# EAGLE design Rwanda Sensor Breakout (EAGLE 9.5.2)
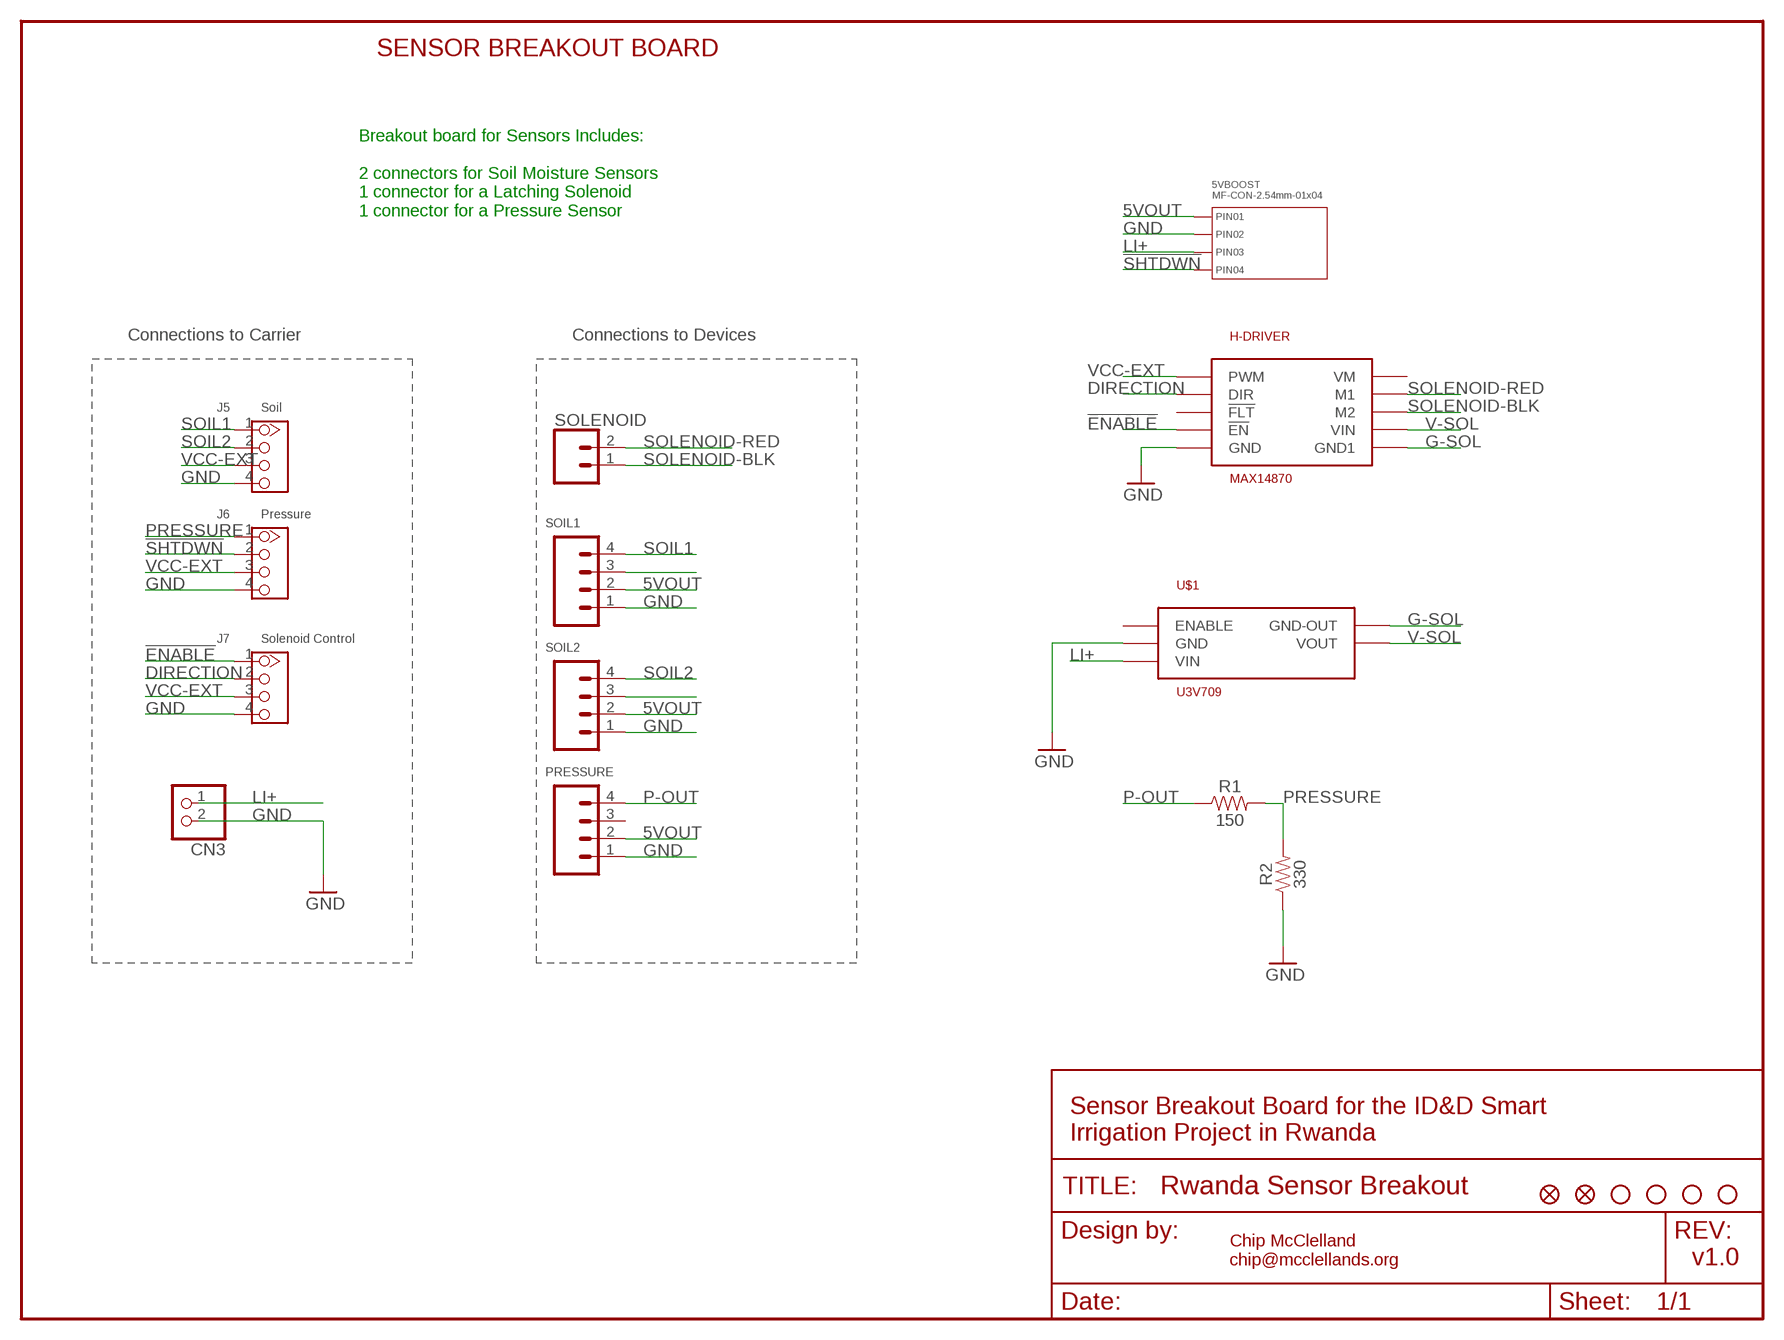
[diagram p0: schematic, sheet 1]

## Parts
5VBOOST  MF-CON-2.54mm-01x04  U1V11F5_PTH_2.54MM  [PTH_2.54MM_01X04]
CN3  JST_2PIN-SMT-RA  [JST-PH-2-SMT-RA]
FD1  FIDUCIALUFIDUCIAL  [FIDUCIAL-MICRO]
FD2  FIDUCIALUFIDUCIAL  [FIDUCIAL-MICRO]
FRAME1  FRAME-LETTER  [CREATIVE_COMMONS]
H-DRIVER  MAX14870  [MAX14870-BREAKOUT]
J5  Soil  GROVE-CONNECTOR-DIP(4P-2.0)  [HW4-2.0]
J6  Pressure  GROVE-CONNECTOR-DIP(4P-2.0)  [HW4-2.0]
J7  Solenoid Control  GROVE-CONNECTOR-DIP(4P-2.0)  [HW4-2.0]
JP3  STAND-OFF  [STAND-OFF]
JP4  STAND-OFF  [STAND-OFF]
JP5  STAND-OFF  [STAND-OFF]
JP6  STAND-OFF  [STAND-OFF]
PRESSURE  Soil  CONN_04SCREW  [SCREWTERMINAL-3.5MM-4]
R1  150  0.3OHM-0805-1/8W-1%  [0805]
R2  330  0.3OHM-0805-1/8W-1%  [0805]
SOIL1  Soil  CONN_04SCREW  [SCREWTERMINAL-3.5MM-4]
SOIL2  Soil  CONN_04SCREW  [SCREWTERMINAL-3.5MM-4]
SOLENOID  CONN_025MM  [SCREWTERMINAL-5MM-2]
U$1  U3V709  [U3V70X-BREAKOUT]

## Nets
5VOUT: 5VBOOST.P$1(PIN1) PRESSURE.2 SOIL1.2 SOIL2.2
!ENABLE: H-DRIVER.P$4(!EN) J7.1
!SHTDWN: 5VBOOST.P$4(PIN4) J6.2
DIRECTION: H-DRIVER.P$2(DIR) J7.2
G-SOL: H-DRIVER.P$6(GND1) U$1.GOUT1(GND-OUT) U$1.GOUT(GND-OUT)
GND: 5VBOOST.P$2(PIN2) CN3.2 H-DRIVER.P$5(GND) J5.4 J6.4 J7.4 PRESSURE.1 R2.1 SOIL1.1 SOIL2.1 U$1.GIN1(GND) U$1.GIN(GND)
LI+: 5VBOOST.P$3(PIN3) CN3.1 U$1.VIN U$1.VIN1(VIN)
N$2: SOIL1.3
N$7: SOIL2.3
P-OUT: PRESSURE.4 R1.1
PRESSURE: J6.1 R1.2 R2.2
SOIL1: J5.1 SOIL1.4
SOIL2: J5.2 SOIL2.4
SOLENOID-BLK: H-DRIVER.P$8(M2) SOLENOID.1
SOLENOID-RED: H-DRIVER.P$9(M1) SOLENOID.2
V-SOL: H-DRIVER.P$7(VIN) U$1.VOUT U$1.VOUT1(VOUT)
VCC-EXT: H-DRIVER.P$1(PWM) J5.3 J6.3 J7.3
Unconnected: H-DRIVER.P$3(!FLT) H-DRIVER.P$10(VM) PRESSURE.3 U$1.ENABLE

## Notes on the sheet
- SENSOR BREAKOUT BOARD
- Breakout board for Sensors Includes:
  
  2 connectors for Soil Moisture Sensors
  1 connector for a Latching Solenoid
  1 connector for a Pressure Sensor
- Connections to Carrier | Connections to Devices
- Sensor Breakout Board for the ID&D Smart
  Irrigation Project in Rwanda
- Chip McClelland
  chip@mcclellands.org
- v1.0

## Library data of the parts
5VBOOST = Rwanda-Sensor-Breakout:U1V11F5: Library: MF_Connectors Description: Header Connector with 04 Positions and 01 Rows. Use the LABEL Attribute to label the pin on the schematic and PCB. You can remove the attributes on the PCB by using the SMASH function on the part and then deleting the text.; HOUSEPART: YES; MPN: MF-CON-2.54mm-01x04; POPULATE: 1; URL: https://factory.macrofab.com/part/MF-CON-2.54mm-01x04
CN3 = adafruit:JST_2PIN: JST 2-Pin Connectors of various flavors SMT-RA (S2B-PH-SM4) 4UConnector #17311 SMT (B2B-PH-SM4) THM-RA (S2B-PH) THM (B2B-PH)
FD1 FD2 = SparkFun-Aesthetics:FIDUCIAL: Fiducial Alignment Points Point-of-reference for pick-and-place machines and other optical instruments.; POPULATE: 0
FRAME1 = SparkFun-Aesthetics:FRAME-LETTER: Schematic Frame - Letter Standard 8.5x11 US Letter frame; POPULATE: 0
H-DRIVER = Rwanda-Sensor-Breakout:MAX14870
J5-J7 = OPL_Connector:GROVE-CONNECTOR-DIP(4P-2.0): 320110033; VALUE: 4P-2.0
JP3-JP6 = SparkFun-Hardware:STAND-OFF: Stand Off Drill holes for mechanically mounting via screws, standoffs, etc. Note: Use the keepout ring to avoid running the screw head into surrounding components. Variant Overviews STAND-OFF - Mechanical footprint for a #4 phillips button head screw. STAND-OFF-TIGHT - Mechanical footprint for a #4 phillips button head screw, Example SparkFun Products Screw - Phillips Head (1/4", 4-40, 10 pack) <https://www.sparkfun.com/products/10453> (PRT-10453) Screw - Phillips Head (1/2", 4-40, 10 pack) <https://www.sparkfun.com/products/10452> (PRT-10452) Screw - Phillips Head (3/4", 4-40, 10 pack) <https://www.sparkfun.com/products/10451> (PRT-10451) Screw - Phillips Head (1", 4-40, 10 pack) <https://www.sparkfun.com/products/10450> (PRT-10450); POPULATE: 0
PRESSURE SOIL1 SOIL2 = SparkFun-Connectors:CONN_04: Multi connection point. Often used as Generic Header-pin footprint for 0.1 inch spaced/style header connections On any of the 0.1 inch spaced packages, you can populate with these: Break Away Headers - Straight <https://www.sparkfun.com/products/116> (PRT-00116) Break Away Male Headers - Right Angle <https://www.sparkfun.com/products/553> (PRT-00553) Female Headers <https://www.sparkfun.com/products/115> (PRT-00115) Break Away Headers - Machine Pin <https://www.sparkfun.com/products/117> (PRT-00117) Break Away Female Headers - Swiss Machine Pin <https://www.sparkfun.com/products/743> (PRT-00743) For SCREWTERMINALS and SPRING TERMINALS visit here: Screw Terimnals on SparkFun.com <https://www.sparkfun.com/search/results?term=Screw+Terminals> (5mm/3.5mm/2.54mm spacing) This device is also useful as a general connection point to wire up your design to another part of your project. Our various solder wires solder well into these plated through hole pads. Hook-Up Wire - Assortment (Stranded, 22 AWG) <https://www.sparkfun.com/products/11375> (PRT-11375) Hook-Up Wire - Assortment (Solid Core, 22 AWG) <https://www.sparkfun.com/products/11367> (PRT-11367) View the entire wire category on our website here <https://www.sparkfun.com/categories/141> Special notes: Molex polarized connector foot print use with SKU : PRT-08231 with associated crimp pins and housings. 1MM SMD Version SKU: PRT-10208; PROD_ID: 2xCONN-08399; SF_ID: 2xPRT-08084
R1 R2 = SparkFun-Resistors:0.3OHM: 0.3Ω resistor A resistor is a passive two-terminal electrical component that implements electrical resistance as a circuit element. Resistors act to reduce current flow, and, at the same time, act to lower voltage levels within circuits. - Wikipedia; PROD_ID: RES-11622; VALUE: 0.3
SOLENOID = SparkFun-Connectors:CONN_02: Multi connection point. Often used as Generic Header-pin footprint for 0.1 inch spaced/style header connections On any of the 0.1 inch spaced packages, you can populate with these: Break Away Headers - Straight <https://www.sparkfun.com/products/116> (PRT-00116) Break Away Male Headers - Right Angle <https://www.sparkfun.com/products/553> (PRT-00553) Female Headers <https://www.sparkfun.com/products/115> (PRT-00115) Break Away Headers - Machine Pin <https://www.sparkfun.com/products/117> (PRT-00117) Break Away Female Headers - Swiss Machine Pin <https://www.sparkfun.com/products/743> (PRT-00743) For SCREWTERMINALS and SPRING TERMINALS visit here: Screw Terimnals on SparkFun.com <https://www.sparkfun.com/search/results?term=Screw+Terminals> (5mm/3.5mm/2.54mm spacing) This device is also useful as a general connection point to wire up your design to another part of your project. Our various solder wires solder well into these plated through hole pads. Hook-Up Wire - Assortment (Stranded, 22 AWG) <https://www.sparkfun.com/products/11375> (PRT-11375) Hook-Up Wire - Assortment (Solid Core, 22 AWG) <https://www.sparkfun.com/products/11367> (PRT-11367) View the entire wire category on our website here <https://www.sparkfun.com/categories/141> Special notes: Molex polarized connector foot print use with: PRT-08233 with associated crimp pins and housings. 2.54_SCREWTERM for use with PRT-10571. 3.5mm Screw Terminal footprints for PRT-08084 5mm Screw Terminal footprints for use with PRT-08432; SF_SKU: PRT-08432
U$1 = Rwanda-Sensor-Breakout:U3V709

## Net classes
0 default: width 0.203 mm, drill 0.33 mm

## Board
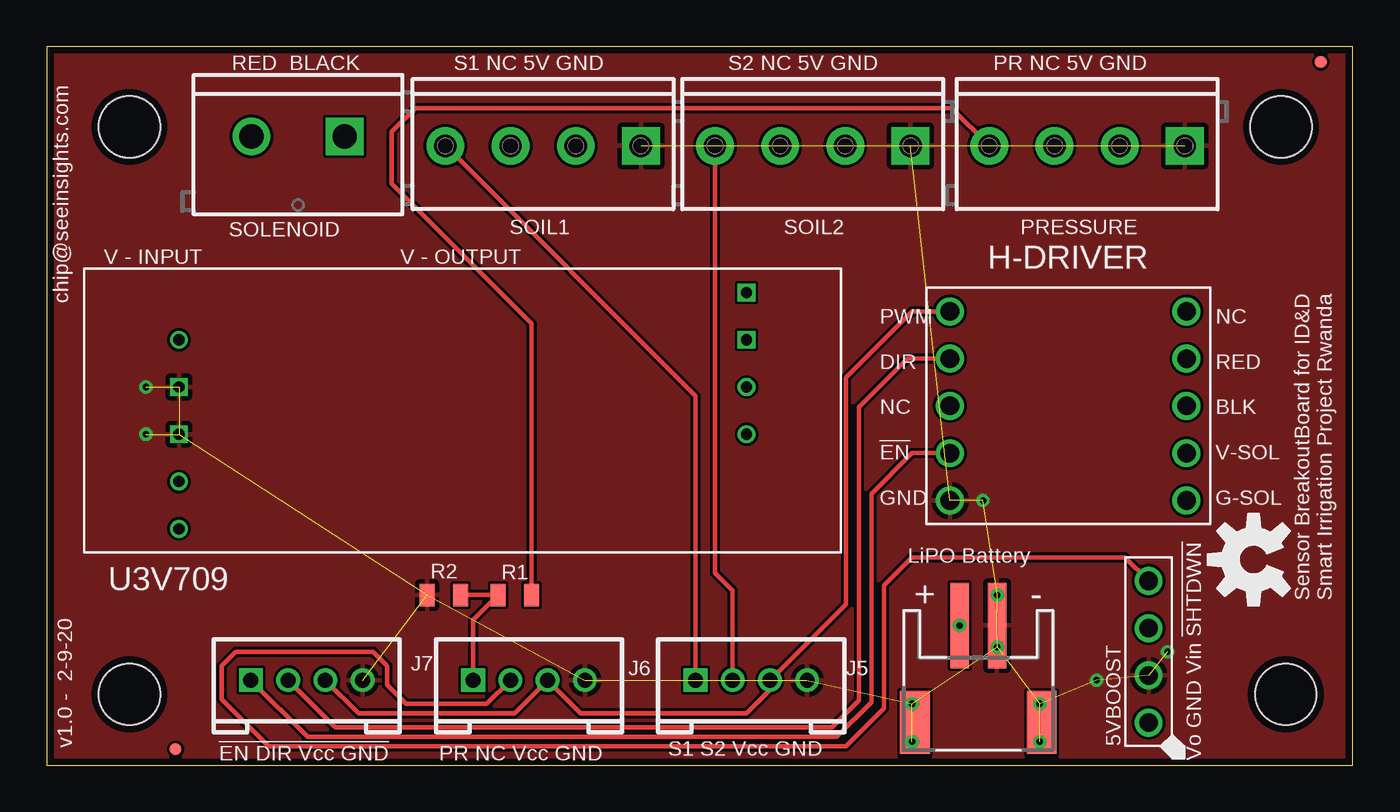
[diagram p1: board, top side]
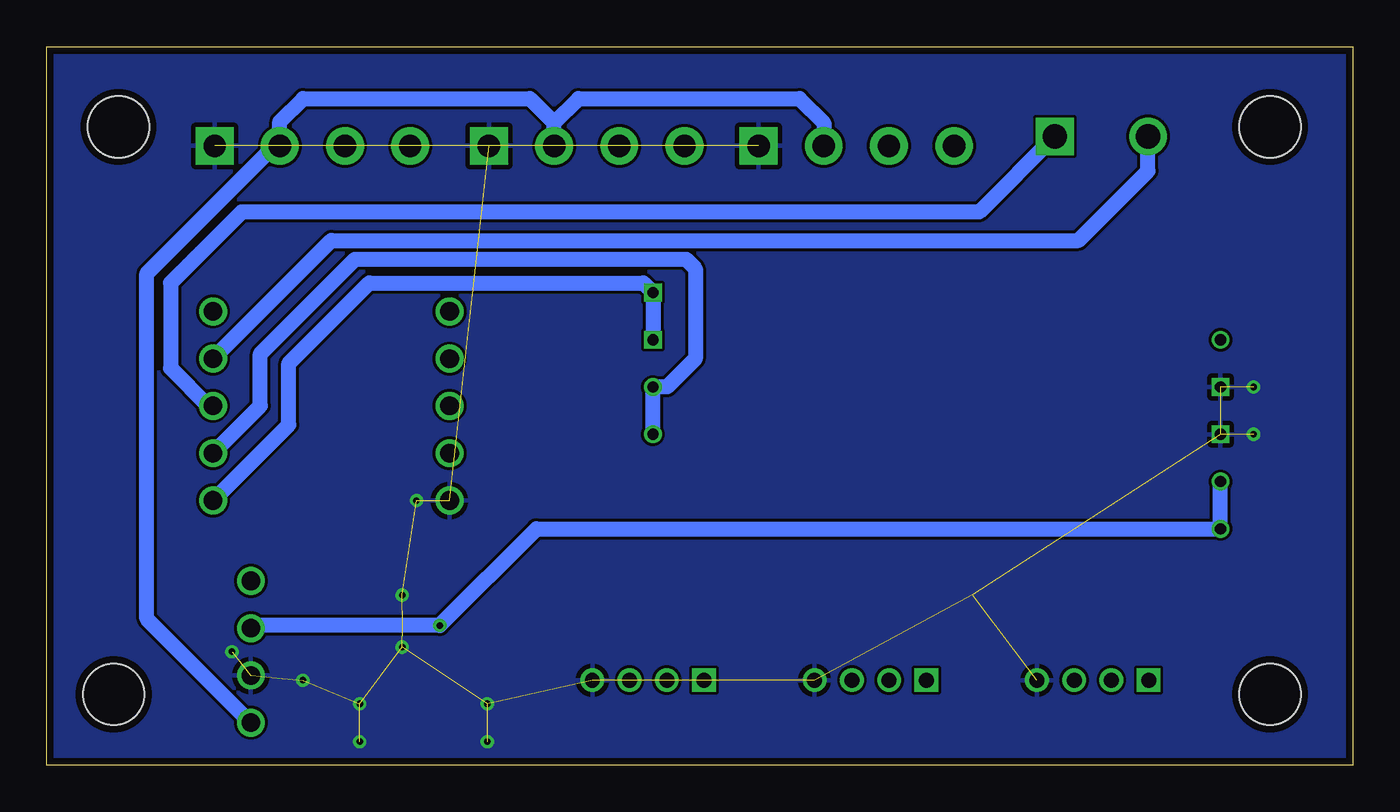
[diagram p2: board, bottom side, seen from below]

Size 70.15 x 38.61 mm. Coordinates in mm from the lower left corner, seen from the top.
Outline: 0,0 70.16,0 70.16,38.61 0,38.61 0,0
Copper layers (1*16): Top 0.0356mm / dielectric 1.5011mm / Bottom 0.0356mm
Design rules "LaenPCBOrder": minimum track width 6mil, minimum drill 13mil, track to track 6mil, track to pad 6mil, pad to pad 6mil, via to via 6mil, smd to smd 6mil, copper to edge 15mil, drill to drill 6mil, minimum pad ring 7mil, minimum via ring 7mil, stop-mask expansion 3mil, vias tented up to drill 0mil, thermal gap 10mil

### Footprints (pad centres in the part's own frame; a part is rotated, then mirrored left to right if it is on the bottom)
PTH_2.54MM_01X04 = drill 1: P$1 -3.81,0; P$2 -1.27,0; P$3 1.27,0; P$4 3.81,0
JST-PH-2-SMT-RA = smd 1 x 4.6: 1 1,-3.7; 2 -1,-3.7 | smd 1.6 x 3.4: NC1 -3.4,1.5; NC2 3.4,1.5
FIDUCIAL-MICRO = smd 0.635 x 0.635: 1 0,0
MAX14870-BREAKOUT = drill 1: P$1 -6.35,5.08; P$2 -6.35,2.54; P$3 -6.35,0; P$4 -6.35,-2.54; P$5 -6.35,-5.08; P$6 6.35,-5.08; P$7 6.35,-2.54; P$8 6.35,0; P$9 6.35,2.54; P$10 6.35,5.08
HW4-2.0 = drill 0.8 pad 1.27 square: 1 -3,0 | drill 0.8 pad 1.27: 2 -1,0; 3 1,0; 4 3,0
STAND-OFF = hole 3.302: 0,0
SCREWTERMINAL-3.5MM-4 = drill 1.2 pad 2.032 square: 1 0,0 | drill 1.2 pad 2.032: 2 3.5,0; 3 7,0; 4 10.5,0
0805 = smd 0.8 x 1.2: 1 -0.9,0; 2 0.9,0
SCREWTERMINAL-5MM-2 = drill 1.3 pad 2.032 square: 1 0,0 | drill 1.3 pad 2.032: 2 5,0
U3V70X-BREAKOUT = drill 0.6: ENABLE -15.24,3.81; VIN -15.24,-6.35; VIN1 -15.24,-3.81; VOUT 15.24,1.27; VOUT1 15.24,-1.27 | drill 0.6 square: GIN -15.24,-1.27; GIN1 -15.24,1.27; GOUT 15.24,6.35; GOUT1 15.24,3.81

### Placement (x,y rotation side)
5VBOOST  59.18,6.1 90 top
CN3  50.04,3.81 180 top
FD1  68.43,37.77 0 top
FD2  6.93,0.86 0 top
FRAME1  0.03,-11.81 0 top  (outside the outline)
H-DRIVER  54.86,19.3 0 top
J5  37.85,4.57 0 top
J6  25.91,4.57 0 top
J7  13.97,4.57 0 top
JP3  66.29,34.29 0 top
JP4  66.55,3.81 90 top
JP5  4.45,34.29 0 top
JP6  4.45,3.81 0 top
PRESSURE  61.13,33.27 180 top
R1  25.15,9.14 180 top
R2  21.34,9.14 0 top
SOIL1  31.92,33.27 180 top
SOIL2  46.4,33.27 180 top
SOLENOID  16,33.78 180 top
U$1  22.35,19.05 0 top
U$2  [OSHW-LOGO-M]  64.82,11.05 90 top

### Tracks (layer width: path | path; a pad name or v marks a point on that pad's centre or on a via)
5VOUT
  Bottom 0.813: 5VBOOST.P$1 64.77,7.87 64.77,26.42 57.91,33.27 PRESSURE.2 57.63,34.57 56.39,35.81 44.2,35.81 42.9,34.51 | SOIL2.2 42.9,34.51 | 42.9,34.51 41.6,35.81 29.72,35.81 28.42,34.51 SOIL1.2
!ENABLE
  Top 0.254: J7.1 14.02,1.52 42.42,1.52 44.29,3.4 44.29,14.57 46.48,16.76 H-DRIVER.P$4
!SHTDWN
  Top 0.254: J6.2 23.64,3.3 19.3,3.3 18.29,4.32 18.29,5.33 17.53,6.1 10.16,6.1 9.4,5.33 9.4,3.56 11.94,1.02 42.93,1.02 44.96,3.05 44.96,9.65 46.48,11.18 57.91,11.18 5VBOOST.P$4
DIRECTION
  Top 0.254: J7.2 15.51,2.03 42.16,2.03 43.63,3.5 43.63,19.24 46.23,21.84 H-DRIVER.P$2
G-SOL
  Bottom 0.813: U$1.GOUT1 U$1.GOUT 38.1,25.91 52.83,25.91 57.15,21.59 57.15,18.29 H-DRIVER.P$6
GND  (via drill 0.35)  (22 unrouted)
  other vias: 51.05,9.14 46.48,3.3 46.48,1.27 53.34,3.3 53.34,1.27 60.2,6.1 56.39,4.57 50.29,14.22 5.33,20.32 5.33,17.78 51.05,6.35
  pour Top (rank 2): -5.82,43.53 73.6,43.68 73.54,-2.04 -5.82,-2.19
  pour Bottom: -5.1,42.99 72.89,42.86 72.7,-2.41 -4.9,-2.39
LI+  (via drill 0.35)
  Bottom 0.813: 5VBOOST.P$3 59.04,7.51 CN3.1 43.85,12.7 U$1.VIN U$1.VIN1
  other vias: 49.04,7.51
P-OUT
  Top 0.254: R1.1 26.05,23.74 18.54,31.24 18.54,34.04 19.81,35.31 48.6,35.31 PRESSURE.4
PRESSURE
  Top 0.254: R2.2 R1.2 22.91,7.81 J6.1
SOIL1
  Top 0.254: SOIL1.4 34.85,19.85 J5.1
SOIL2
  Top 0.254: SOIL2.4 35.9,10.35 36.85,9.4 J5.2
SOLENOID-BLK
  Bottom 0.813: SOLENOID.1 20.07,29.72 59.69,29.72 63.5,25.91 63.5,21.34 61.47,19.3 H-DRIVER.P$8
SOLENOID-RED
  Bottom 0.813: H-DRIVER.P$9 54.86,28.19 14.73,28.19 11,31.92 SOLENOID.2
V-SOL
  Bottom 0.813: U$1.VOUT1 U$1.VOUT 36.83,20.32 35.31,21.84 35.31,26.67 35.81,27.18 53.59,27.18 58.67,22.1 58.67,19.3 H-DRIVER.P$7
VCC-EXT
  Top 0.254: H-DRIVER.P$1 46.48,24.38 42.93,20.83 42.93,8.65 J5.3 38.85,4.05 37.59,2.79 28.69,2.79 J6.3 26.91,4.56 25.15,2.79 16.75,2.79 J7.3

### Text on the board
tNames: RED BLACK | S1 NC 5V GND | S2 NC 5V GND | PR NC 5V GND | V - INPUT V - OUTPUT | chip@seeinsights.com | PWM / / DIR / / NC / / !EN / / GND | NC / / RED / / BLK / / V-SOL / / G-SOL | LiPO Battery | Sensor BreakoutBoard for ID&D / Smart Irrigation Project Rwanda | v1.0 - 2-9-20 | S1 S2 Vcc GND | !EN DIR Vcc GND | PR NC Vcc GND | Vo GND Vin !SHTDWN